# Altium schematic sheet 3.RK3588_POWER.SchDoc
size A4; SheetNumber: 3; SheetTotal: 21
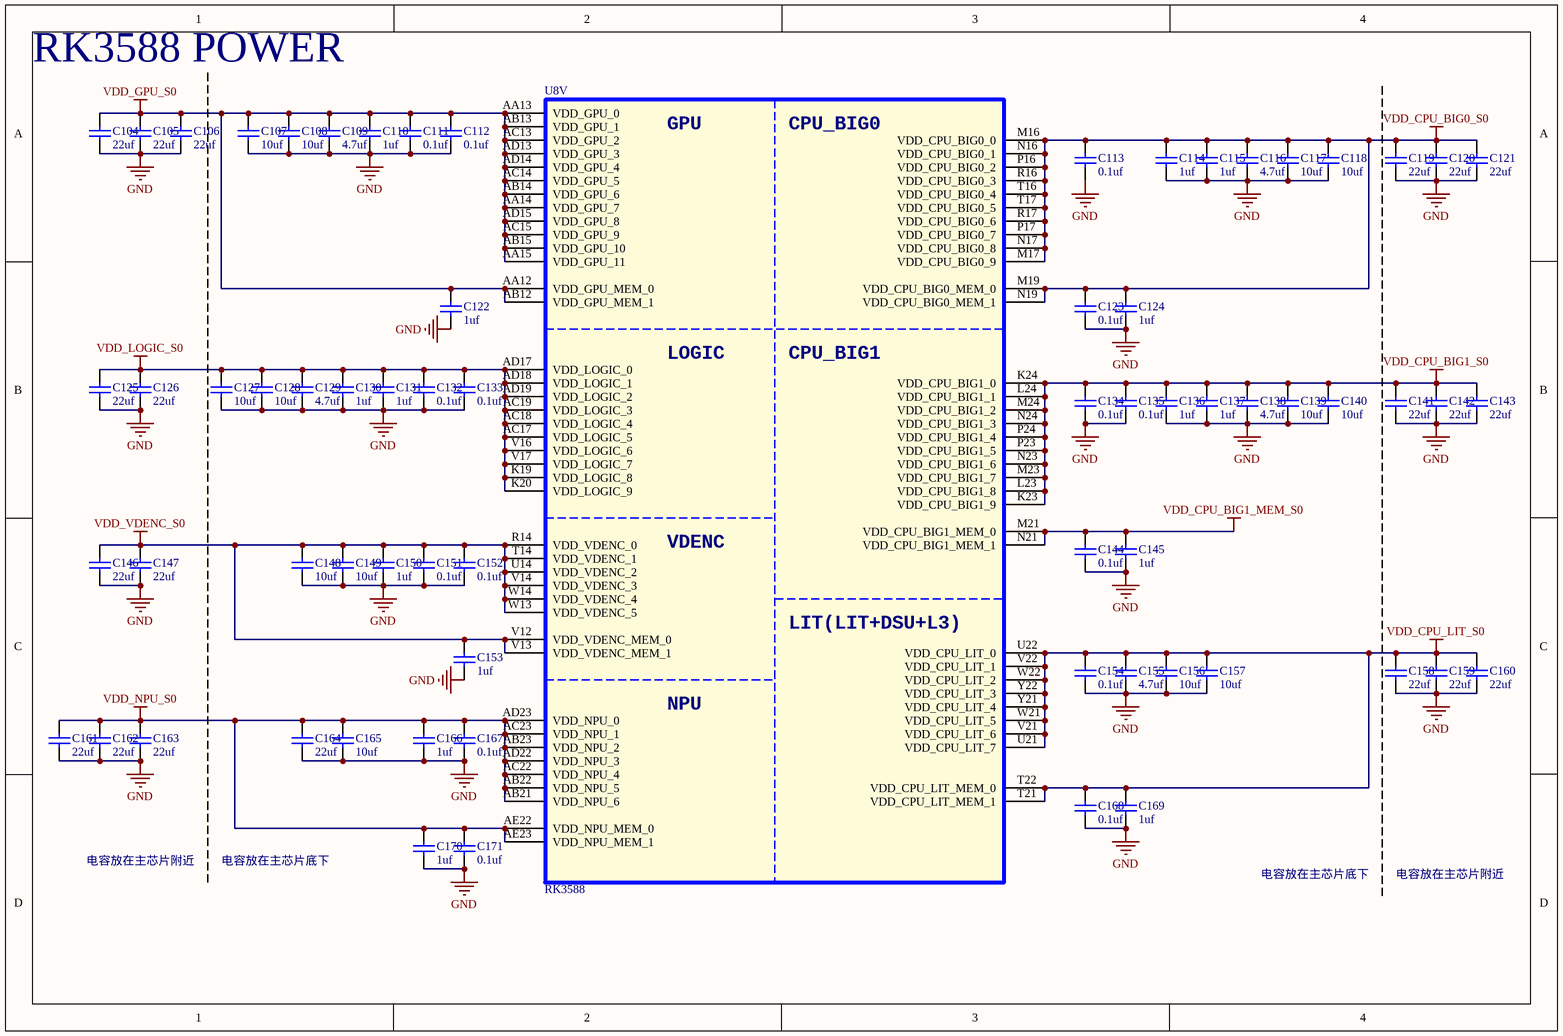
[diagram p0: 3.RK3588_POWER.SchDoc]

## Parts
C104  22uf  [C0603_L]
C105  22uf  [C0603_L]
C106  22uf  [C0603_L]
C107  10uf  [C0402_L]
C108  10uf  [C0402_L]
C109  4.7uf  [C0402_L]
C110  1uf  [C0201_L]
C111  0.1uf  [C0201_L]
C112  0.1uf  [C0201_L]
C113  0.1uf  [C0201_L]
C114  1uf  [C0201_L]
C115  1uf  [C0201_L]
C116  4.7uf  [C0201_L]
C117  10uf  [C0402_L]
C118  10uf  [C0402_L]
C119  22uf  [C0603_L]
C120  22uf  [C0603_L]
C121  22uf  [C0603_L]
C122  1uf  [C0201_L]
C123  0.1uf  [C0201_L]
C124  1uf  [C0201_L]
C125  22uf  [C0603_L]
C126  22uf  [C0603_L]
C127  10uf  [C0402_L]
C128  10uf  [C0402_L]
C129  4.7uf  [C0402_L]
C130  1uf  [C0201_L]
C131  1uf  [C0201_L]
C132  0.1uf  [C0201_L]
C133  0.1uf  [C0201_L]
C134  0.1uf  [C0201_L]
C135  0.1uf  [C0201_L]
C136  1uf  [C0201_L]
C137  1uf  [C0201_L]
C138  4.7uf  [C0402_L]
C139  10uf  [C0402_L]
C140  10uf  [C0402_L]
C141  22uf  [C0603_L]
C142  22uf  [C0603_L]
C143  22uf  [C0603_L]
C144  0.1uf  [C0201_L]
C145  1uf  [C0201_L]
C146  22uf  [C0603_L]
C147  22uf  [C0603_L]
C148  10uf  [C0402_L]
C149  10uf  [C0402_L]
C150  1uf  [C0201_L]
C151  0.1uf  [C0201_L]
C152  0.1uf  [C0201_L]
C153  1uf  [C0201_L]
C154  0.1uf  [C0201_L]
C155  4.7uf  [C0402_L]
C156  10uf  [C0402_L]
C157  10uf  [C0402_L]
C158  22uf  [C0603_L]
C159  22uf  [C0603_L]
C160  22uf  [C0603_L]
C161  22uf  [C0603_L]
C162  22uf  [C0603_L]
C163  22uf  [C0603_L]
C164  22uf  [C0402_L]
C165  10uf  [C0402_L]
C166  1uf  [C0201_L]
C167  0.1uf  [C0201_L]
C168  0.1uf  [C0201_L]
C169  1uf  [C0201_L]
C170  1uf  [C0201_L]
C171  0.1uf  [C0201_L]
U8  RK3588  [BGA1088_23R00X23R00X2R00]  (part V of 26)

## Nets
GND: C104.1 C105.1 C106.1 C107.1 C108.1 C109.1 C110.1 C111.1 C112.1 C113.1 C114.1 C115.1 C116.1 C117.1 C118.1 C119.1 C120.1 C121.1 C122.1 C123.1 C124.1 C125.1 C126.1 C127.1 C128.1 C129.1 C130.1 C131.1 C132.1 C133.1 C134.1 C135.1 C136.1 C137.1 C138.1 C139.1 C140.1 C141.1 C142.1 C143.1 C144.1 C145.1 C146.1 C147.1 C148.1 C149.1 C150.1 C151.1 C152.1 C153.1 C154.1 C155.1 C156.1 C157.1 C158.1 C159.1 C160.1 C161.1 C162.1 C163.1 C164.1 C165.1 C166.1 C167.1 C168.1 C169.1 C170.1 C171.1
VDD_CPU_BIG0_S0: C113.2 C114.2 C115.2 C116.2 C117.2 C118.2 C119.2 C120.2 C121.2 C123.2 C124.2 U8.M16(VDD_CPU_BIG0_0) U8.M17(VDD_CPU_BIG0_9) U8.M19(VDD_CPU_BIG0_MEM_0) U8.N16(VDD_CPU_BIG0_1) U8.N17(VDD_CPU_BIG0_8) U8.N19(VDD_CPU_BIG0_MEM_1) U8.P16(VDD_CPU_BIG0_2) U8.P17(VDD_CPU_BIG0_7) U8.R16(VDD_CPU_BIG0_3) U8.R17(VDD_CPU_BIG0_6) U8.T16(VDD_CPU_BIG0_4) U8.T17(VDD_CPU_BIG0_5)
VDD_CPU_BIG1_MEM_S0: C144.2 C145.2 U8.M21(VDD_CPU_BIG1_MEM_0) U8.N21(VDD_CPU_BIG1_MEM_1)
VDD_CPU_BIG1_S0: C134.2 C135.2 C136.2 C137.2 C138.2 C139.2 C140.2 C141.2 C142.2 C143.2 U8.K23(VDD_CPU_BIG1_9) U8.K24(VDD_CPU_BIG1_0) U8.L23(VDD_CPU_BIG1_8) U8.L24(VDD_CPU_BIG1_1) U8.M23(VDD_CPU_BIG1_7) U8.M24(VDD_CPU_BIG1_2) U8.N23(VDD_CPU_BIG1_6) U8.N24(VDD_CPU_BIG1_3) U8.P23(VDD_CPU_BIG1_5) U8.P24(VDD_CPU_BIG1_4)
VDD_CPU_LIT_S0: C154.2 C155.2 C156.2 C157.2 C158.2 C159.2 C160.2 C168.2 C169.2 U8.T21(VDD_CPU_LIT_MEM_1) U8.T22(VDD_CPU_LIT_MEM_0) U8.U21(VDD_CPU_LIT_7) U8.U22(VDD_CPU_LIT_0) U8.V21(VDD_CPU_LIT_6) U8.V22(VDD_CPU_LIT_1) U8.W21(VDD_CPU_LIT_5) U8.W22(VDD_CPU_LIT_2) U8.Y21(VDD_CPU_LIT_4) U8.Y22(VDD_CPU_LIT_3)
VDD_GPU_S0: C104.2 C105.2 C106.2 C107.2 C108.2 C109.2 C110.2 C111.2 C112.2 C122.2 U8.AA12(VDD_GPU_MEM_0) U8.AA13(VDD_GPU_0) U8.AA14(VDD_GPU_7) U8.AA15(VDD_GPU_11) U8.AB12(VDD_GPU_MEM_1) U8.AB13(VDD_GPU_1) U8.AB14(VDD_GPU_6) U8.AB15(VDD_GPU_10) U8.AC13(VDD_GPU_2) U8.AC14(VDD_GPU_5) U8.AC15(VDD_GPU_9) U8.AD13(VDD_GPU_3) U8.AD14(VDD_GPU_4) U8.AD15(VDD_GPU_8)
VDD_LOGIC_S0: C125.2 C126.2 C127.2 C128.2 C129.2 C130.2 C131.2 C132.2 C133.2 U8.AC17(VDD_LOGIC_5) U8.AC18(VDD_LOGIC_4) U8.AC19(VDD_LOGIC_3) U8.AD17(VDD_LOGIC_0) U8.AD18(VDD_LOGIC_1) U8.AD19(VDD_LOGIC_2) U8.K19(VDD_LOGIC_8) U8.K20(VDD_LOGIC_9) U8.V16(VDD_LOGIC_6) U8.V17(VDD_LOGIC_7)
VDD_NPU_S0: C161.2 C162.2 C163.2 C164.2 C165.2 C166.2 C167.2 C170.2 C171.2 U8.AB21(VDD_NPU_6) U8.AB22(VDD_NPU_5) U8.AB23(VDD_NPU_2) U8.AC22(VDD_NPU_4) U8.AC23(VDD_NPU_1) U8.AD22(VDD_NPU_3) U8.AD23(VDD_NPU_0) U8.AE22(VDD_NPU_MEM_0) U8.AE23(VDD_NPU_MEM_1)
VDD_VDENC_S0: C146.2 C147.2 C148.2 C149.2 C150.2 C151.2 C152.2 C153.2 U8.R14(VDD_VDENC_0) U8.T14(VDD_VDENC_1) U8.U14(VDD_VDENC_2) U8.V12(VDD_VDENC_MEM_0) U8.V13(VDD_VDENC_MEM_1) U8.V14(VDD_VDENC_3) U8.W13(VDD_VDENC_5) U8.W14(VDD_VDENC_4)

## Notes on the sheet
- RK3588 POWER
- 电容放在主芯片附近
- 电容放在主芯片底下
- (in symbol SOC_RK3588, part V) GPU; CPU_BIG0; LOGIC; CPU_BIG1; VDENC; LIT(LIT+DSU+L3); NPU

## Library data of the parts
C104-C171 = C: 贴片电容/MLCC电容
U8 = SOC_RK3588: ROCKCHIP SOC